# Altium schematic sheet stlinkv2.1.SchDoc
size A4
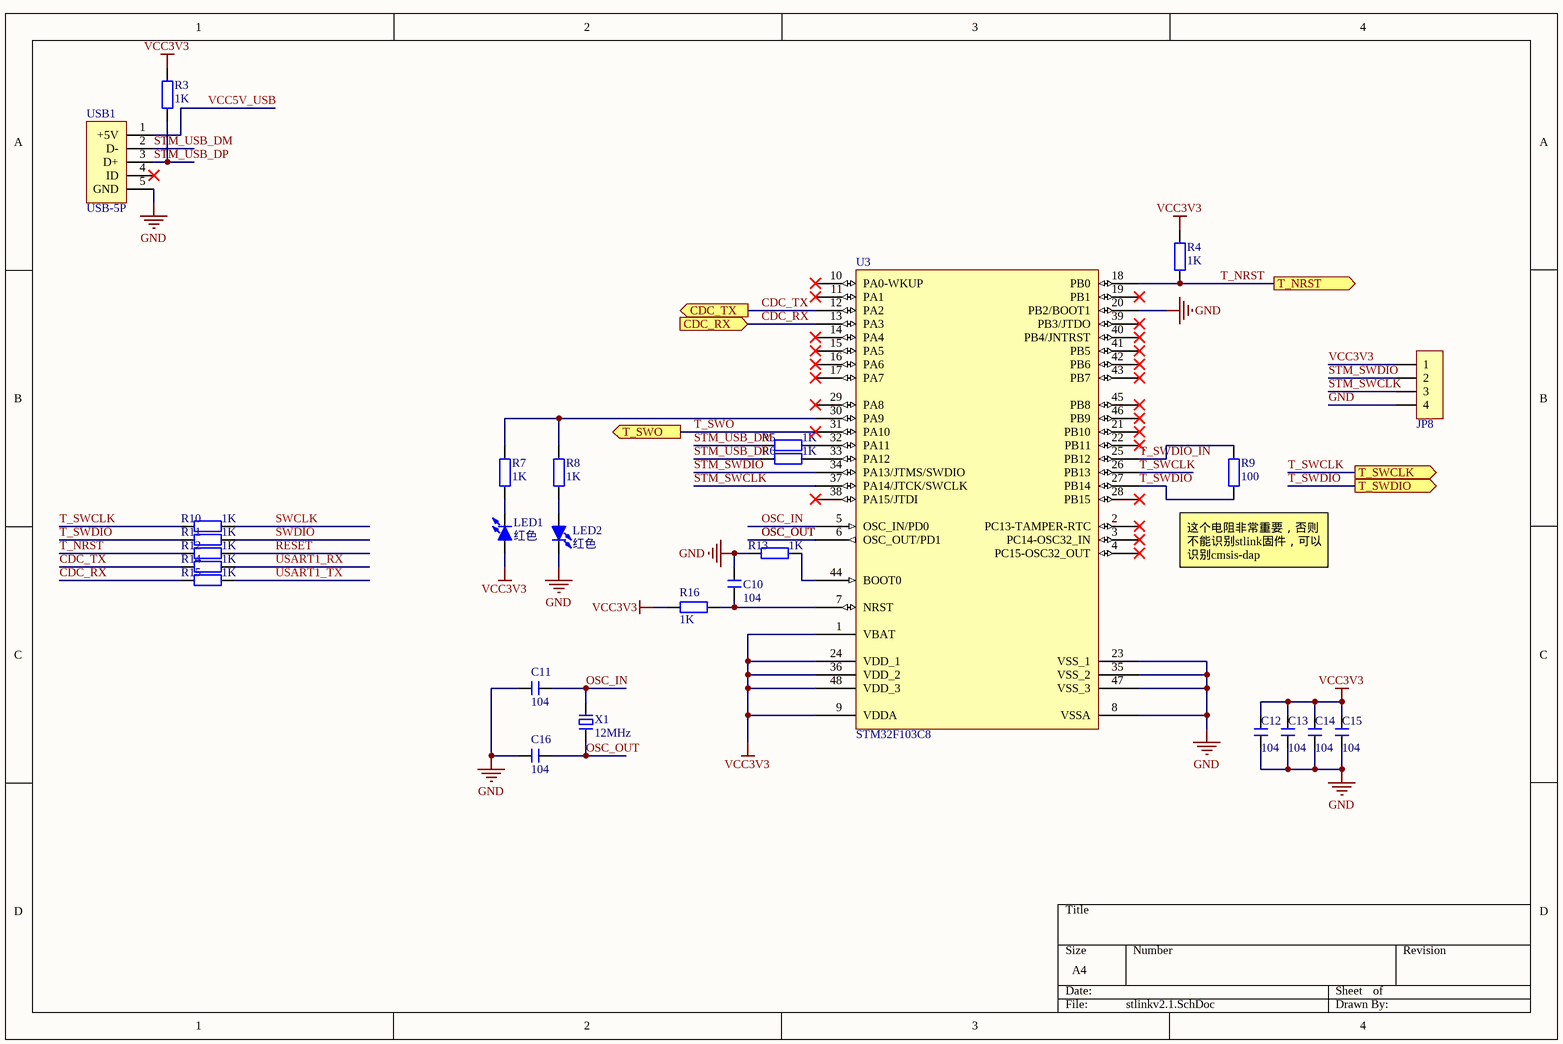
[diagram p0: stlinkv2.1.SchDoc]

## Parts
C10  104  [C 0603_L]
C11  104  [C 0603_L]
C12  104  [C 0603_L]
C13  104  [C 0603_L]
C14  104  [C 0603_L]
C15  104  [C 0603_L]
C16  104  [C 0603_L]
JP8  HDR-1X4  [HDR2.54-LI-4P]  (value not drawn)
LED1  红色  [LED 0603B]
LED2  红色  [LED 0603B]
R3  1K  [R 0603_L]
R4  1K  [R 0603_L]
R5  1K  [R 0603_L]
R6  1K  [R 0603_L]
R7  1K  [R 0603_L]
R8  1K  [R 0603_L]
R9  100  [R 0603_L]
R10  1K  [R 0603_L]
R11  1K  [R 0603_L]
R12  1K  [R 0603_L]
R13  1K  [R 0603_L]
R14  1K  [R 0603_L]
R15  1K  [R 0603_L]
R16  1K  [R 0603_L]
U3  STM32F103C8  [LQFP48 7X7_M]
USB1  USB-5P  [USB-MICRO_B]
X1  12MHz  [OSC 5032-2P]

## Ports
CDC_RX (in), CDC_TX (out), T_NRST (out), T_SWCLK (out), T_SWDIO (out), T_SWO (out)

## Nets
GND: C10.1 C11.1 C12.2 C13.2 C14.2 C15.2 C16.1 JP8.4 LED2.2(K) R13.2 U3.8(VSSA) U3.20(PB2/BOOT1) U3.23(VSS_1) U3.35(VSS_2) U3.47(VSS_3) USB1.5(GND)
VCC3V3: C12.1 C13.1 C14.1 C15.1 JP8.1 LED1.1(A) R3.1 R4.2 R16.2 U3.1(VBAT) U3.9(VDDA) U3.24(VDD_1) U3.36(VDD_2) U3.48(VDD_3)
CDC_RX: R15.2 U3.13(PA3) ; port CDC_RX
CDC_TX: R14.2 U3.12(PA2) ; port CDC_TX
OSC_IN: C11.2 U3.5(OSC_IN/PD0) X1.2
OSC_OUT: C16.2 U3.6(OSC_OUT/PD1) X1.1
RESET: R12.1
STM_SWCLK: JP8.3 U3.37(PA14/JTCK/SWCLK)
STM_SWDIO: JP8.2 U3.34(PA13/JTMS/SWDIO)
STM_USB_DM: R5.2 USB1.2(D-)
STM_USB_DP: R3.2 R6.2 USB1.3(D+)
SWCLK: R10.1
SWDIO: R11.1
T_NRST: R4.1 R12.2 U3.18(PB0) ; port T_NRST
T_SWCLK: R10.2 U3.26(PB13) ; port T_SWCLK
T_SWDIO: R9.1 R11.2 U3.27(PB14) ; port T_SWDIO
T_SWDIO_IN: R9.2 U3.25(PB12)
T_SWO: U3.31(PA10) ; port T_SWO
USART1_RX: R14.1
USART1_TX: R15.1
VCC5V_USB: USB1.1(+5V)
NetC10_2: C10.2 R16.1 U3.7(NRST)
NetLED1_2: LED1.2(K) R7.1
NetLED2_1: LED2.1(A) R8.1
NetR5_1: R5.1 U3.32(PA11)
NetR6_1: R6.1 U3.33(PA12)
NetR7_2: R7.2 R8.2 U3.30(PA9)
NetR13_1: R13.1 U3.44(BOOT0)

Not connected (* = marked no-connect by the designer): U3 2(PC13-TAMPER-RTC)* 3(PC14-OSC32_IN)* 4(PC15-OSC32_OUT)* 10(PA0-WKUP)* 11(PA1)* 14(PA4)* 15(PA5)* 16(PA6)* 17(PA7)* 19(PB1)* 21(PB10)* 22(PB11)* 28(PB15)* 29(PA8)* 38(PA15/JTDI)* 39(PB3/JTDO)* 40(PB4/JNTRST)* 41(PB5)* 42(PB6)* 43(PB7)* 45(PB8)* 46(PB9)*; USB1 4(ID)*

## Notes on the sheet
- (near R9) 这个电阻非常重要，否则不能识别stlink固件，可以识别cmsis-dap

## Library data of the parts
C10-C16 = C: 无极性贴片电容; 版权归属: 源创客; BOM名称: 无极性贴片电容; 学习资源: www.ooocke.com
JP8 = Header 4: 4P接插件; 版权归属: 源创客; BOM名称: 4P接插件; 学习资源: www.ooocke.com
LED1 LED2 = LED-SMD: 贴片LED; 版权归属: 源创客; BOM名称: 贴片LED; 学习资源: www.ooocke.com
R3-R16 = R: 贴片电阻; 版权归属: 源创客; BOM名称: 贴片电阻; 学习资源: www.ooocke.com
U3 = STM32F103C8: Flaah:64/RAM:20/IO:36; BOM名称: 32位STM单片机; 版权归属: 源创客; 学习资源: www.ooocke.com
USB1 = USB-5P: 微型USB母座; 版权归属: 源创客; BOM名称: 微型USB母座; 学习资源: www.ooocke.com
X1 = XTAL-2P: 2脚无源脚晶振; 版权归属: 源创客; BOM名称: 2脚无源脚晶振; 学习资源: www.ooocke.com